# EAGLE design untitled (EAGLE 9.6.2)
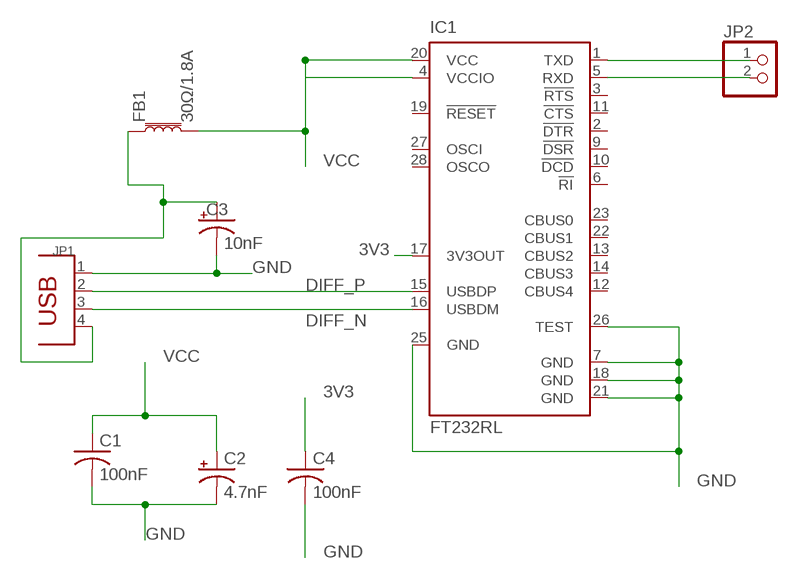
[diagram p0: schematic, sheet 1]

## Parts
C1  100nF  C-USC0805  [C0805]
C2  4.7nF  CPOL-USB45181A  [B45181A]
C3  10nF  CPOL-USB45181A  [B45181A]
C4  100nF  C-USC0805  [C0805]
FB1  30Ω/1.8A  FERRITE_BEAD-0603  [0603]
IC1  FT232RL  [SSOP28]
JP1  DIP-USB-A-TYPE-FMAL(4+2P-2.0-90D)  [USB4+2P-2.0-90D]
JP2  PINHD-1X2  [1X02]

## Nets
3V3: C4.1 IC1.17(3V3OUT)
DIFF_N [diff_pairs]: IC1.16(USBDM) JP1.3
DIFF_P [diff_pairs]: IC1.15(USBDP) JP1.2
GND: C1.2 C2.- C3.- C4.2 IC1.7(GND) IC1.18(GND) IC1.21(GND) IC1.25(GND) IC1.26(TEST) JP1.1
N$1: IC1.1(TXD) JP2.1
N$2: IC1.5(RXD) JP2.2
N$3: C3.+ FB1.1 JP1.4
VCC: C1.1 C2.+ FB1.2 IC1.4(VCCIO) IC1.20(VCC)
Unconnected: IC1.2(!DTR) IC1.3(!RTS) IC1.6(!RI) IC1.9(!DSR) IC1.10(!DCD) IC1.11(!CTS) IC1.12(CBUS4) IC1.13(CBUS2) IC1.14(CBUS3) IC1.19(!RESET) IC1.22(CBUS1) IC1.23(CBUS0) IC1.27(OSCI) IC1.28(OSCO) JP1.SG1(GND) JP1.SG2(GND)

## Library data of the parts
C1 C4 = adafruit:C-US: CAPACITOR, American symbol
C2 C3 = adafruit:CPOL-US: POLARIZED CAPACITOR, American symbol
FB1 = SparkFun-Coils:FERRITE_BEAD: Ferrite Bead (blocks, cores, rings, chokes, etc.) Inductor with layers of ferrite used to suppress high frequencies. Often used to isolate high frequency noise. SparkFun Products: IOIO-OTG - V2.2 <https://www.sparkfun.com/products/13613> SparkFun SAMD21 Mini Breakout <https://www.sparkfun.com/products/13664> SparkFun 6 Degrees of Freedom Breakout - LSM6DS3 <https://www.sparkfun.com/products/13339> SparkFun SAMD21 Dev Breakout <https://www.sparkfun.com/products/13672>; PROD_ID: NDUC-07859
IC1 = ftdichip:FT232R: Source: http://www.ftdichip.com/Documents/DataSheets/DS_FT232R_v104.pdf; MPN: FT232RL; OC_FARNELL: 1146032; OC_NEWARK: 91K9918
JP1 = OPL_Connector:DIP-USB-A-TYPE-FMAL(4+2P-2.0-90D): 320010007
JP2 = pinhead:PINHD-1X2: PIN HEADER

## Net classes
1 diff_pairs: width 0.406 mm

## Board
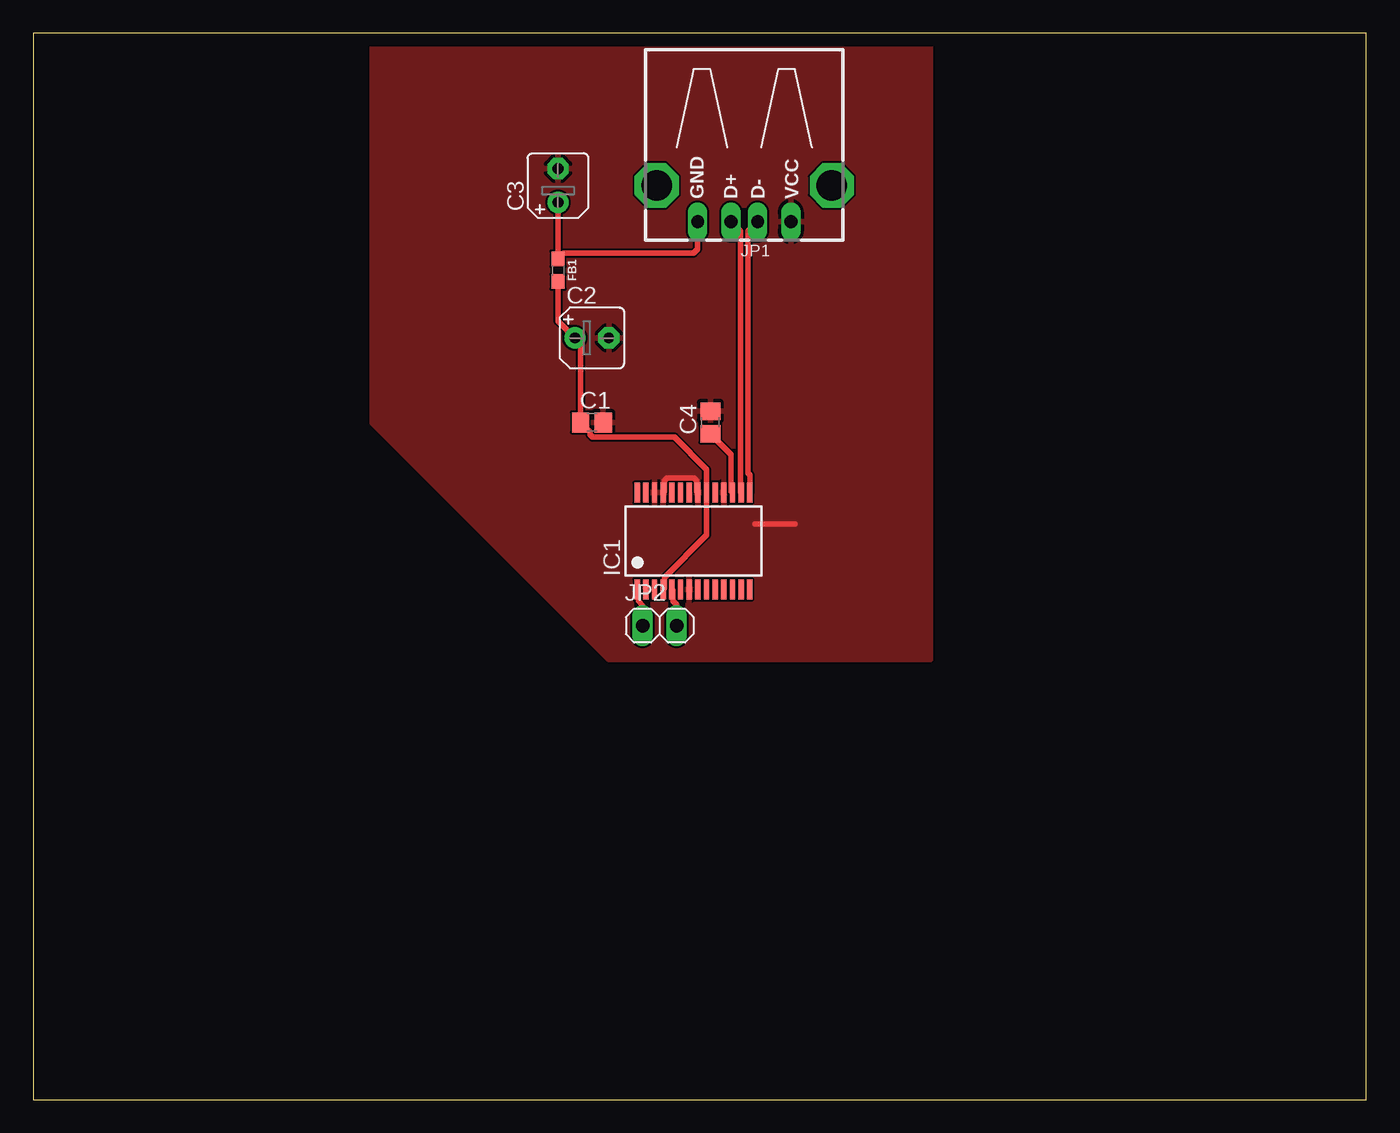
[diagram p1: board, top side]

Size 100 x 80 mm. Coordinates in mm from the lower left corner, seen from the top.
Outline: 0,0 100,0 100,80 0,80 0,0
Copper layers (1*16): Top 0.035mm / dielectric 1.5mm / Bottom 0.035mm
Design rules "default": minimum track width 6mil, minimum drill 0.35mm, track to track 6mil, track to pad 6mil, pad to pad 6mil, via to via 6mil, smd to smd 6mil, copper to edge 40mil, drill to drill 6mil, minimum pad ring 10mil, minimum via ring 8mil, stop-mask expansion 4mil, vias tented up to drill 0mil, thermal gap 10mil

### Footprints (pad centres in the part's own frame; a part is rotated, then mirrored left to right if it is on the bottom)
C0805 = smd 1.3 x 1.5: 1 -0.85,0; 2 0.85,0
B45181A = drill 0.813 pad 1.6: + -1.27,0 | drill 0.813 pad 1.6 octagon: - 1.27,0
0603 = smd 1.1 x 1: 1 -0.85,0; 2 0.85,0
SSOP28 = smd 0.4 x 1.5: 1 -4.225,-3.625; 2 -3.575,-3.625; 3 -2.925,-3.625; 4 -2.275,-3.625; 5 -1.625,-3.625; 6 -0.975,-3.625; 7 -0.325,-3.625; 8 0.325,-3.625; 9 0.975,-3.625; 10 1.625,-3.625; 11 2.275,-3.625; 12 2.925,-3.625; 13 3.575,-3.625; 14 4.225,-3.625; 15 4.225,3.625; 16 3.575,3.625; 17 2.925,3.625; 18 2.275,3.625; 19 1.625,3.625; 20 0.975,3.625; 21 0.325,3.625; 22 -0.325,3.625; 23 -0.975,3.625; 24 -1.625,3.625; 25 -2.275,3.625; 26 -2.925,3.625; 27 -3.575,3.625; 28 -4.225,3.625
USB4+2P-2.0-90D = drill 0.95 long: 1 -3.5,2.71; 2 -1,2.71; 3 1,2.71; 4 3.5,2.71 | drill 2.3 octagon: SG1 -6.57,0; SG2 6.57,0
1X02 = drill 1.016 long: 1 -1.27,0; 2 1.27,0

### Placement (x,y rotation side)
C1  41.91,50.8 0 top
C2  41.91,57.15 0 top
C3  39.37,68.58 90 top
C4  50.8,50.8 90 top
FB1  39.37,62.23 270 top
IC1  49.53,41.91 0 top
JP1  53.34,68.58 180 top
JP2  46.99,35.56 0 top

### Tracks (layer width: path | path; a pad name or v marks a point on that pad's centre or on a via)
3V3
  Top 0.406: IC1.17 52.36,45.63 52.36,48.39 C4.1
DIFF_N
  Top 0.406: JP1.3 53.06,65.15 53.06,45.58 IC1.16
DIFF_P
  Top 0.406: JP1.2 53.62,65.15 53.62,46.99 53.76,46.85 IC1.15
GND
  Top 0.406: 54.16,43.18 55.88,43.18 57.15,43.18 | IC1.25 47.35,45.63 47.35,46.43 47.56,46.64 49.55,46.64 49.76,46.43 49.76,45.63 IC1.21
  pour Top: 67.31,33.02 67.31,80.01 25.4,80.01 25.4,50.8 43.18,33.02
N$1
  Top 0.406: IC1.1 45.4,38.19 45.4,37.39 45.72,37.07 JP2.1
N$2
  Top 0.406: IC1.5 48,38.19 48,37.39 48.26,37.13 JP2.2
N$3
  Top 0.406: C3.+ FB1.1 39.79,63.5 49.53,63.5 49.84,63.81 JP1.4
VCC
  Top 0.406: FB1.2 39.37,58.42 C2.+ 41.06,56.73 C1.1 41.75,50.11 41.75,49.9 41.96,49.69 48.1,49.69 50.51,47.28 IC1.20 50.51,42.34 47.35,39.18 47.35,38.38 IC1.4